# Altium schematic sheet LED.SchDoc
size A4; SheetNumber: 13; SheetTotal: 13
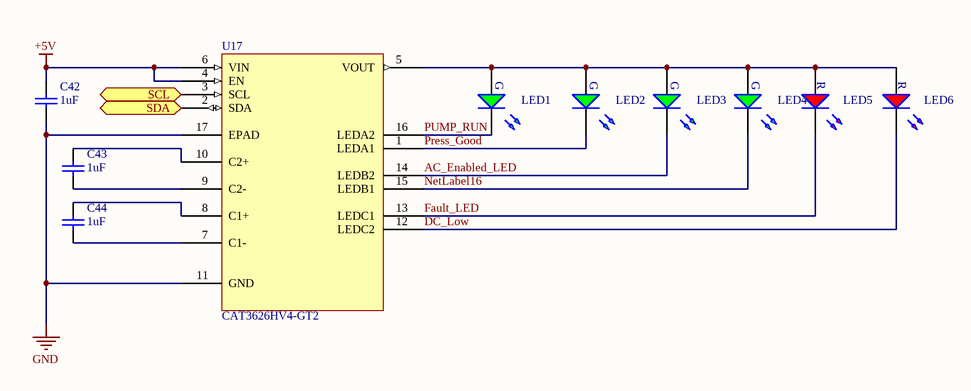
[diagram p0: LED.SchDoc]

## Parts
C42  1uF  [0603C]
C43  1uF  [0603C]
C44  1uF  [0603C]
LED1  LED-G  [0805D]  (value not drawn)
LED2  LED-G  [0805D]  (value not drawn)
LED3  LED-G  [0805D]  (value not drawn)
LED4  LED-G  [0805D]  (value not drawn)
LED5  LED-R  [0805D]  (value not drawn)
LED6  LED-R  [0805D]  (value not drawn)
U17  CAT3626HV4-GT2  [CAT3626HV4-GT2]

## Ports
SCL (bidir), SDA (bidir)

## Nets
+5V: C42.2 U17.4(EN) U17.6(VIN)
GND: C42.1 U17.11(GND) U17.17(EPAD)
AC_Enabled_LED: LED3.2(G_K) U17.14(LEDB2)
DC_Low: LED6.2(R_K) U17.12(LEDC2)
Fault_LED: LED5.2(R_K) U17.13(LEDC1)
NetLabel16: LED4.2(G_K) U17.15(LEDB1)
Press_Good: LED2.2(G_K) U17.1(LEDA1)
PUMP_RUN: LED1.2(G_K) U17.16(LEDA2)
SCL: U17.3(SCL) ; port SCL
SDA: U17.2(SDA) ; port SDA
NetC43_1: C43.1 U17.9(C2-)
NetC43_2: C43.2 U17.10(C2+)
NetC44_1: C44.1 U17.7(C1-)
NetC44_2: C44.2 U17.8(C1+)
NetLED1_1: LED1.1(G_A) LED2.1(G_A) LED3.1(G_A) LED4.1(G_A) LED5.1(R_A) LED6.1(R_A) U17.5(VOUT)

## Notes on the sheet
- (in symbol 1001-0001) G
- (in symbol 1001-0002) R

## Library data of the parts
C42-C44 = 1000-0007: CAP CER 1UF 25V X5R 0603; Manufacturer: Samsung Electro-Mechanics; Manufacturer Part Number: CL10A105KA8NNNC; id: 376116; inventory_price: 0.01253; x_Capacitance: 1µF; x_Link_Description: Datasheet; x_max_temp: 85°C; x_min_temp: -55°C; x_Tolerance: ±10%; partnumber: 1000-0007; created_on: 4/03/2020 7:09:07 PM; parttype: Ceramic Capacitors; rohs: -1; updated_on: 23/08/2021 6:14:35 PM; x_Link_URL: http://www.samsungsem.com/kr/support/product-search/mlcc/CL10A105KA8NNNC.jsp
LED1-LED4 = 1001-0001: LED GREEN CLEAR 0805 SMD; Manufacturer Part Number: 150080GS75000; Manufacturer: Würth Elektronik; Current: A; Voltage: V; id: 376117; inventory_price: 0.18; x_Capacitance: Not Applicable; x_Link_Description: Datasheet; x_port_to_unleashed: No; Supplier 1: Digikey; Supplier Part Number 1: 1642-1508-1-ND; Mount: SMT; ComponentLink1Description: Datasheet; partnumber: 1001-0001; created_on: 4/03/2020 7:22:47 PM; parttype: LED Indication - Discrete; rohs: 1; updated_on: 12/04/2022 11:43:19 AM; x_current: Not Applicable; x_inductance: Not Applicable; x_Link_URL: https://www.we-online.com/katalog/datasheet/150080GS75000.pdf; x_max_temp: N/A; x_min_temp: N/A; x_Power: Not Applicable; x_resistance: Not Applicable; x_temp_coef: Not Applicable; x_Tolerance: Not Applicable; x_Vol: Not Applicable
LED5 LED6 = 1001-0002: LED RED CLEAR 0805 SMD; Manufacturer Part Number: 150080RS75000; Manufacturer: Würth Elektronik; Current: A; Voltage: V; id: 376134; inventory_price: 0.18; x_Capacitance: Not Applicable; x_Link_Description: Datasheet; x_port_to_unleashed: No; Supplier 1: Digikey; Supplier Part Number 1: 1642-1508-1-ND; Mount: SMT; ComponentLink1Description: Datasheet; partnumber: 1001-0002; created_on: 4/03/2020 10:57:11 PM; parttype: LED Indication - Discrete; rohs: 1; updated_on: 12/04/2022 11:43:19 AM; x_current: Not Applicable; x_inductance: Not Applicable; x_Link_URL: https://www.we-online.com/katalog/datasheet/150080RS75000.pdf; x_max_temp: N/A; x_min_temp: N/A; x_Power: Not Applicable; x_resistance: Not Applicable; x_temp_coef: Not Applicable; x_Tolerance: Not Applicable; x_Vol: Not Applicable
U17 = CAT3626HV4-GT2: Mfr_Name: onsemi; inventory_price: 2.5; Copyright: Copyright (C) 2022 Ultra Librarian. All rights reserved.; Manufacturer_Part_Number: CAT3626HV4-GT2; Digi-Key_Part_Number_1: 2156-CAT3626HV4-GT2-ND; Digi-Key_Part_Number_2: 2156-CAT3626HV4-GT2-OS-ND; Digi-Key_Part_Number_3: CAT3626HV4-GT2OSCT-ND; Digi-Key_Part_Number_4: CAT3626HV4-GT2OSDKR-ND; Digi-Key_Part_Number_5: CAT3626HV4-GT2OSTR-ND; RefDes: RefDes; Type: DEV; partnumber: CAT3626HV4-GT2; Manufacturer Part Number: CAT3626HV4-GT2; URL Datasheet: https://www.onsemi.com/pdf/datasheet/cat3626-d.pdf; Digikey PN: CAT3626HV4-GT2OSCT-ND; manufacturer: Onsemi; parttype: PMIC - LED Drivers